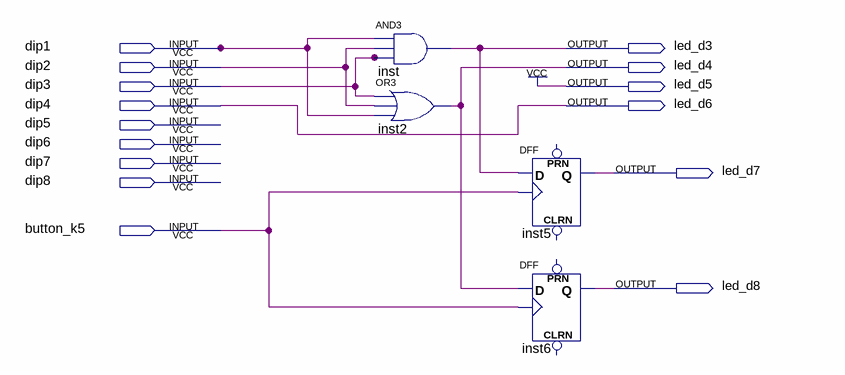
[diagram p0: schematic sheet]
// Quartus schematic SimpleSchematic.bdf as structural Verilog: 4 symbols, 15 pins
module SimpleSchematic (
  input  dip1,
  input  dip2,
  input  dip3,
  input  dip4,
  input  dip5,
  input  dip6,
  input  dip7,
  input  dip8,
  input  button_k5,
  output led_d3,
  output led_d4,
  output led_d5,
  output led_d6,
  output led_d7,
  output led_d8
);

  and inst (led_d3, dip1, dip2, dip3);
  or inst2 (led_d4, dip3, dip2, dip1);
  DFF inst5 (.CLK(button_k5), .D(led_d3), .Q(led_d7));  // open: CLRN, PRN
  DFF inst6 (.CLK(button_k5), .D(led_d4), .Q(led_d8));  // open: CLRN, PRN

  assign led_d5 = 1'b1;
  assign led_d6 = dip4;
endmodule
